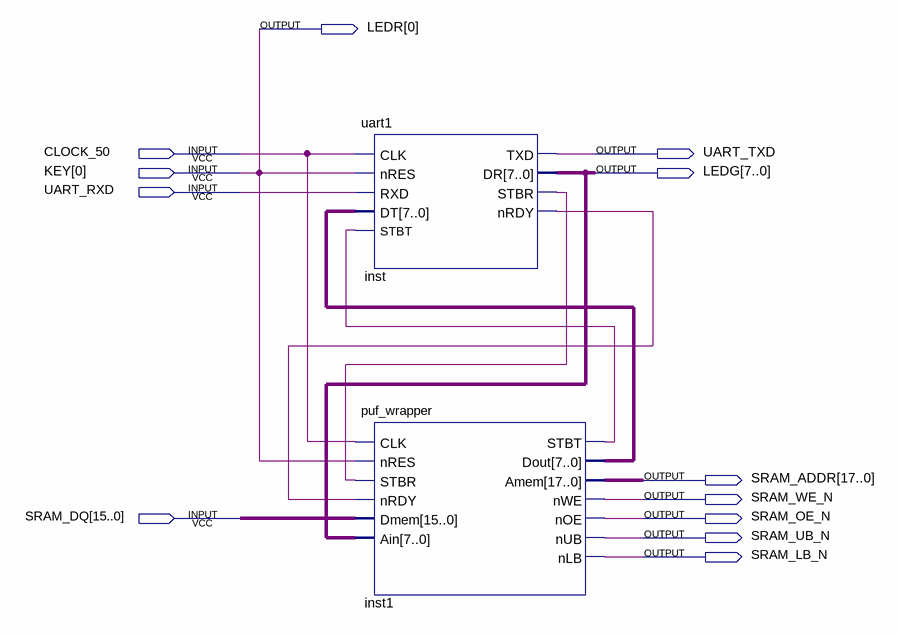
[diagram p0: schematic sheet]
// Quartus schematic rs232ex2.bdf as structural Verilog: 2 symbols, 12 pins
module rs232ex2 (
  input  CLOCK_50,
  input  [0:0] KEY,
  input  UART_RXD,
  input  [15:0] SRAM_DQ,
  output [0:0] LEDR,
  output UART_TXD,
  output [7:0] LEDG,
  output [17:0] SRAM_ADDR,
  output SRAM_WE_N,
  output SRAM_OE_N,
  output SRAM_UB_N,
  output SRAM_LB_N
);

  wire inst1_stbt, inst_nrdy, inst_stbr;
  wire [7:0] inst1_dout;

  uart1 inst (
    .CLK(CLOCK_50), .nRES(KEY[0]), .RXD(UART_RXD), .DT(inst1_dout), .STBT(inst1_stbt), .TXD(UART_TXD),
    .DR(LEDG), .STBR(inst_stbr), .nRDY(inst_nrdy));
  puf_wrapper inst1 (
    .CLK(CLOCK_50), .nRES(KEY[0]), .STBR(inst_stbr), .nRDY(inst_nrdy), .Dmem(SRAM_DQ), .Ain(LEDG),
    .STBT(inst1_stbt), .Dout(inst1_dout), .Amem(SRAM_ADDR), .nWE(SRAM_WE_N), .nOE(SRAM_OE_N),
    .nUB(SRAM_UB_N), .nLB(SRAM_LB_N));

  assign LEDR[0] = KEY[0];
endmodule
